# Altium schematic sheet PCB-Tester-Board-V1.SchDoc: PCB-Tester top block diagram
size A4; Date: JUN 2020; CheckedBy: Moerz, Hoeren; Author: Rudziński; CompanyName: TDK-Micronas GmbH; DrawnBy: Rudziński; Engineer: Rudziński; Organization: Test Engineering; Address1: Hans-Bunte-Strasse 19; Address2: D-79108 Freiburg; Address3: Germany; DocumentNumber: U33110; Revision: V1.0; SheetNumber: 1; SheetTotal: 20; DateDraw: JUN 2020; DateChecked: 2020-06-19; Workspace: Workspace; TitleTyp: Title-Typ; PageSetup: Record=PageOptions|CenterHorizontal=True|CenterVertical=True|PrintScale=0.97|XCorrection=1.00|YCorrection=1.00|PrintKind=0|BorderSize=5000000|LeftOffset=0|BottomOffset=0|Orientation=2|PaperLength=1000|PaperWidth=1000|Scale=100|PaperSource=7|PrintQuality=-3|MediaType=1|DitherType=10|PrintScaleMode=1|PaperKind=A4|PaperIndex=9
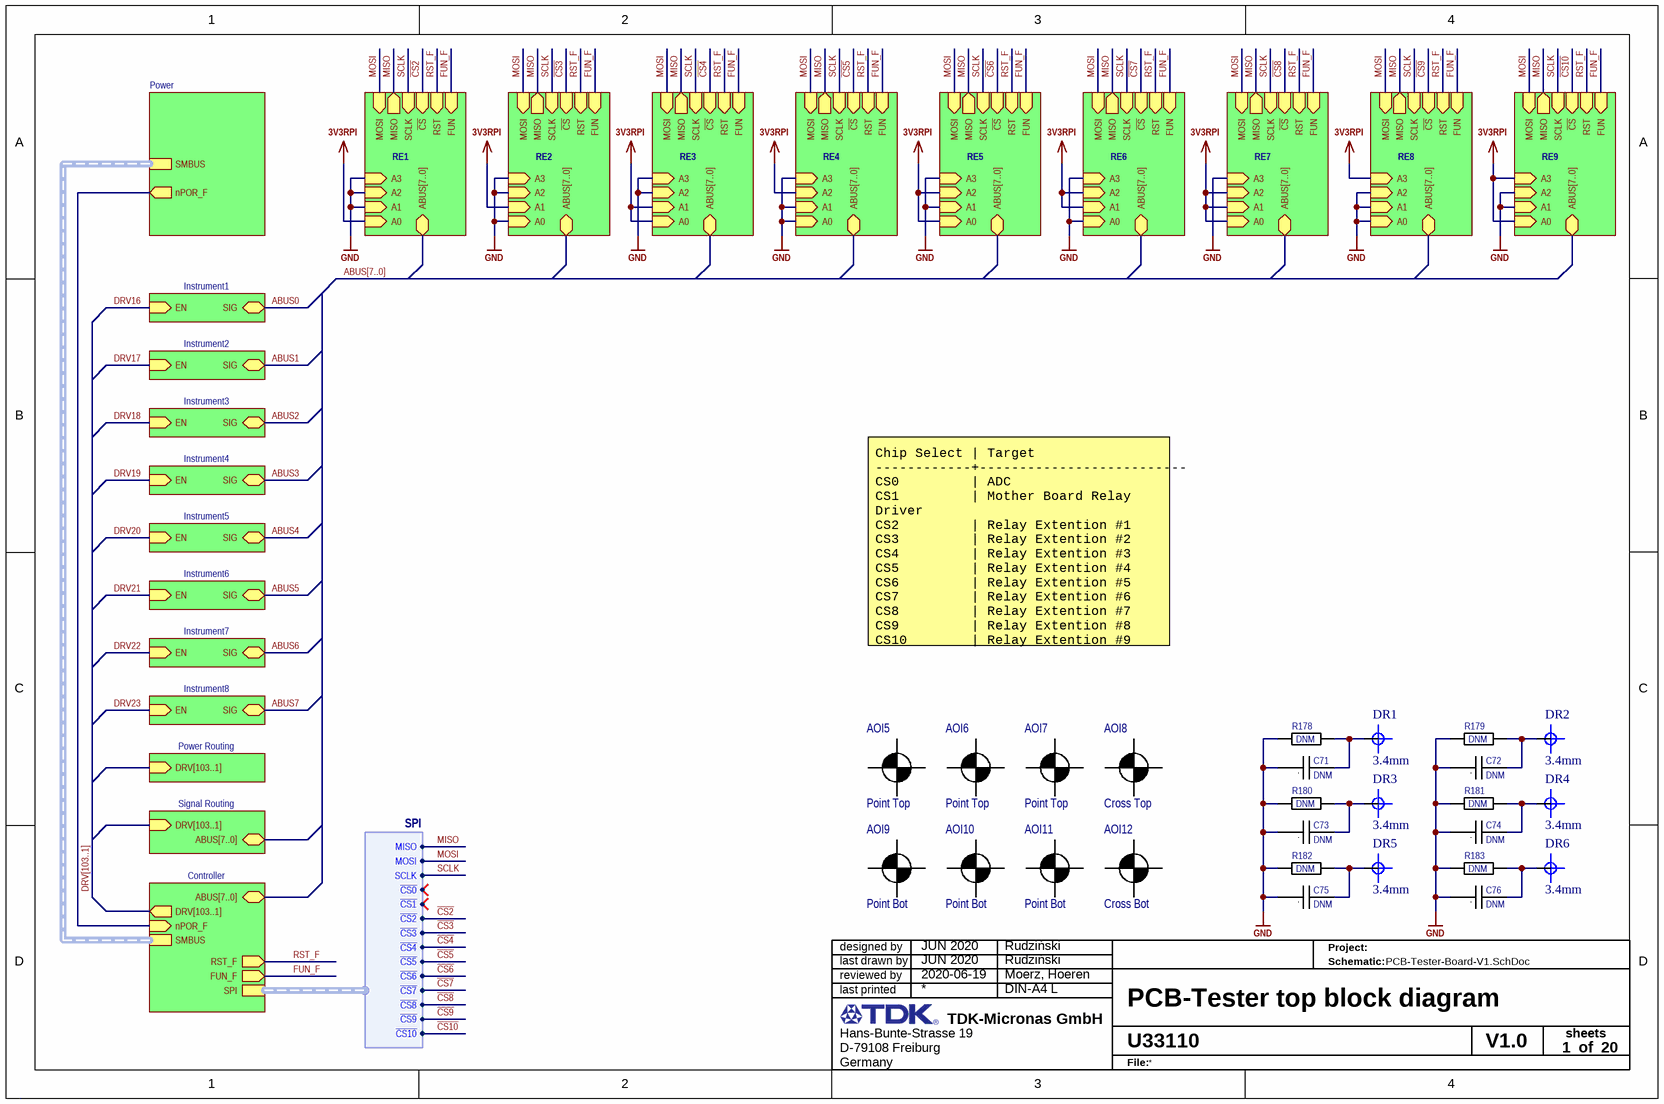
[diagram p0: PCB-Tester-Board-V1.SchDoc]

## Parts
AOI5  Shape: Point Top  [Fiducial Point]  (hidden comment: AOI)  (no BOM)
AOI6  Shape: Point Top  [Fiducial Point]  (hidden comment: AOI)  (no BOM)
AOI7  Shape: Point Top  [Fiducial Point]  (hidden comment: AOI)  (no BOM)
AOI8  Shape: Cross Top  [Fiducial Cross]  (hidden comment: AOI)  (no BOM)
AOI9  Shape: Point Bot  [Fiducial Point]  (hidden comment: AOI)  (no BOM)
AOI10  Shape: Point Bot  [Fiducial Point]  (hidden comment: AOI)  (no BOM)
AOI11  Shape: Point Bot  [Fiducial Point]  (hidden comment: AOI)  (no BOM)
AOI12  Shape: Cross Bot  [Fiducial Cross]  (hidden comment: AOI)  (no BOM)
C71  value DNM  [C1206 Reflow]  (hidden comment: C)  (no BOM)
C72  value DNM  [C1206 Reflow]  (hidden comment: C)  (no BOM)
C73  value DNM  [C1206 Reflow]  (hidden comment: C)  (no BOM)
C74  value DNM  [C1206 Reflow]  (hidden comment: C)  (no BOM)
C75  value DNM  [C1206 Reflow]  (hidden comment: C)  (no BOM)
C76  value DNM  [C1206 Reflow]  (hidden comment: C)  (no BOM)
DR1  3.4mm  [HOLE_3.4mm]  (no BOM)
DR2  3.4mm  [HOLE_3.4mm]  (no BOM)
DR3  3.4mm  [HOLE_3.4mm]  (no BOM)
DR4  3.4mm  [HOLE_3.4mm]  (no BOM)
DR5  3.4mm  [HOLE_3.4mm]  (no BOM)
DR6  3.4mm  [HOLE_3.4mm]  (no BOM)
R178  value DNM  [R1206 Reflow]  (hidden comment: R)  (no BOM)
R179  value DNM  [R1206 Reflow]  (hidden comment: R)  (no BOM)
R180  value DNM  [R1206 Reflow]  (hidden comment: R)  (no BOM)
R181  value DNM  [R1206 Reflow]  (hidden comment: R)  (no BOM)
R182  value DNM  [R1206 Reflow]  (hidden comment: R)  (no BOM)
R183  value DNM  [R1206 Reflow]  (hidden comment: R)  (no BOM)

## Sub-sheets
Controller = Controller.SchDoc: ABUS[7..0] (bidir), SPI (harness SPI), DRV[103..1] (out), SMBUS (harness SMBUS), nPOR_F (in), FUN_F (out), RST_F (out)
Instrument1 = Instrument.SchDoc: EN (in), SIG (bidir)
Instrument2 = Instrument.SchDoc: EN (in), SIG (bidir)
Instrument3 = Instrument.SchDoc: EN (in), SIG (bidir)
Instrument4 = Instrument.SchDoc: EN (in), SIG (bidir)
Instrument5 = Instrument.SchDoc: EN (in), SIG (bidir)
Instrument6 = Instrument.SchDoc: EN (in), SIG (bidir)
Instrument7 = Instrument.SchDoc: EN (in), SIG (bidir)
Instrument8 = Instrument.SchDoc: EN (in), SIG (bidir)
Power = Power.SchDoc: SMBUS (harness SMBUS), nPOR_F (out)
Power Routing = PowerRouting.SchDoc: DRV[103..1] (in)
RE1 = RelayExtension.SchDoc: ABUS[7..0] (bidir), SCLK (in), ~{CS} (in), MISO (out), MOSI (in), A3 (in), A2 (in), A1 (in), A0 (in), RST (in), FUN (in)
RE2 = RelayExtension.SchDoc: ABUS[7..0] (bidir), MOSI (in), MISO (out), ~{CS} (in), SCLK (in), A2 (in), A3 (in), A1 (in), A0 (in), RST (in), FUN (in)
RE3 = RelayExtension.SchDoc: ABUS[7..0] (bidir), MISO (out), SCLK (in), ~{CS} (in), MOSI (in), A2 (in), A3 (in), A1 (in), A0 (in), RST (in), FUN (in)
RE4 = RelayExtension.SchDoc: ABUS[7..0] (bidir), ~{CS} (in), SCLK (in), MOSI (in), MISO (out), A0 (in), A1 (in), A2 (in), A3 (in), RST (in), FUN (in)
RE5 = RelayExtension.SchDoc: ABUS[7..0] (bidir), SCLK (in), MISO (out), MOSI (in), ~{CS} (in), A3 (in), A2 (in), A1 (in), A0 (in), RST (in), FUN (in)
RE6 = RelayExtension.SchDoc: ABUS[7..0] (bidir), MOSI (in), ~{CS} (in), MISO (out), SCLK (in), A3 (in), A0 (in), A1 (in), A2 (in), RST (in), FUN (in)
RE7 = RelayExtension.SchDoc: ABUS[7..0] (bidir), MOSI (in), SCLK (in), MISO (out), ~{CS} (in), A0 (in), A1 (in), A2 (in), A3 (in), RST (in), FUN (in)
RE8 = RelayExtension.SchDoc: ABUS[7..0] (bidir), MOSI (in), MISO (out), ~{CS} (in), SCLK (in), A3 (in), A2 (in), A1 (in), A0 (in), RST (in), FUN (in)
RE9 = RelayExtension.SchDoc: ABUS[7..0] (bidir), MISO (out), SCLK (in), MOSI (in), ~{CS} (in), A3 (in), A2 (in), A1 (in), A0 (in), RST (in), FUN (in)
Signal Routing = SignalRouting.SchDoc: ABUS[7..0] (bidir), DRV[103..1] (in)

## Harnesses
SPI: MISO, MOSI, SCLK, ~{CS0}, ~{CS1}, ~{CS2}, ~{CS3}, ~{CS4}, ~{CS5}, ~{CS6}, ~{CS7}, ~{CS8}, ~{CS9}, ~{CS10}

## Nets
3V3RPI: sheet RE2/A1, sheet RE3/A1, sheet RE3/A0, sheet RE4/A2, sheet RE5/A2, sheet RE5/A0, sheet RE6/A1, sheet RE6/A2, sheet RE7/A0, sheet RE7/A1, sheet RE7/A2, sheet RE8/A3, sheet RE1/A0, sheet RE9/A3, sheet RE9/A0
GND: C71.1 C72.1 C73.1 C74.1 C75.1 C76.1 R178.2 R179.2 R180.2 R181.2 R182.2 R183.2 ; sheet RE2/A2, sheet RE2/A3, sheet RE2/A0, sheet RE3/A2, sheet RE3/A3, sheet RE4/A0, sheet RE4/A1, sheet RE4/A3, sheet RE5/A3, sheet RE5/A1, sheet RE6/A3, sheet RE6/A0, sheet RE7/A3, sheet RE8/A2, sheet RE8/A1, sheet RE8/A0, sheet RE1/A3, sheet RE1/A2, sheet RE1/A1, sheet RE9/A2, sheet RE9/A1
~{CS2}: sheet RE1/~{CS}, sheet Controller/SPI.~{CS2}
~{CS3}: sheet RE2/~{CS}, sheet Controller/SPI.~{CS3}
~{CS4}: sheet RE3/~{CS}, sheet Controller/SPI.~{CS4}
~{CS5}: sheet RE4/~{CS}, sheet Controller/SPI.~{CS5}
~{CS6}: sheet RE5/~{CS}, sheet Controller/SPI.~{CS6}
~{CS7}: sheet RE6/~{CS}, sheet Controller/SPI.~{CS7}
~{CS8}: sheet RE7/~{CS}, sheet Controller/SPI.~{CS8}
~{CS9}: sheet RE8/~{CS}, sheet Controller/SPI.~{CS9}
~{CS10}: sheet RE9/~{CS}, sheet Controller/SPI.~{CS10}
ABUS0: sheet Instrument1/SIG
ABUS1: sheet Instrument2/SIG
ABUS2: sheet Instrument3/SIG
ABUS3: sheet Instrument4/SIG
ABUS4: sheet Instrument5/SIG
ABUS5: sheet Instrument6/SIG
ABUS6: sheet Instrument7/SIG
ABUS7: sheet Instrument8/SIG
DRV16: sheet Instrument1/EN
DRV17: sheet Instrument2/EN
DRV18: sheet Instrument3/EN
DRV19: sheet Instrument4/EN
DRV20: sheet Instrument5/EN
DRV21: sheet Instrument6/EN
DRV22: sheet Instrument7/EN
DRV23: sheet Instrument8/EN
FUN_F: sheet RE2/FUN, sheet Controller/FUN_F, sheet RE3/FUN, sheet RE4/FUN, sheet RE5/FUN, sheet RE6/FUN, sheet RE7/FUN, sheet RE8/FUN, sheet RE1/FUN, sheet RE9/FUN
MISO: sheet RE2/MISO, sheet RE3/MISO, sheet RE4/MISO, sheet RE5/MISO, sheet RE6/MISO, sheet RE7/MISO, sheet RE8/MISO, sheet RE1/MISO, sheet RE9/MISO, sheet Controller/SPI.MISO
MOSI: sheet RE2/MOSI, sheet RE3/MOSI, sheet RE4/MOSI, sheet RE5/MOSI, sheet RE6/MOSI, sheet RE7/MOSI, sheet RE8/MOSI, sheet RE1/MOSI, sheet RE9/MOSI, sheet Controller/SPI.MOSI
RST_F: sheet RE2/RST, sheet Controller/RST_F, sheet RE3/RST, sheet RE4/RST, sheet RE5/RST, sheet RE6/RST, sheet RE7/RST, sheet RE8/RST, sheet RE1/RST, sheet RE9/RST
SCLK: sheet RE2/SCLK, sheet RE3/SCLK, sheet RE4/SCLK, sheet RE5/SCLK, sheet RE6/SCLK, sheet RE7/SCLK, sheet RE8/SCLK, sheet RE1/SCLK, sheet RE9/SCLK, sheet Controller/SPI.SCLK
NetC71_2: C71.2 DR1.1(OUT3) R178.1
NetC72_2: C72.2 DR2.1(OUT3) R179.1
NetC73_2: C73.2 DR3.1(OUT3) R180.1
NetC74_2: C74.2 DR4.1(OUT3) R181.1
NetC75_2: C75.2 DR5.1(OUT3) R182.1
NetC76_2: C76.2 DR6.1(OUT3) R183.1
(unnamed): sheet Power/nPOR_F, sheet Controller/nPOR_F

## Buses and harness runs
bus ABUS[7..0] = sheet Controller/ABUS[7..0] = sheet RE1/ABUS[7..0] = sheet RE2/ABUS[7..0] = sheet RE3/ABUS[7..0] = sheet RE4/ABUS[7..0] = sheet RE5/ABUS[7..0] = sheet RE6/ABUS[7..0] = sheet RE7/ABUS[7..0] = sheet RE8/ABUS[7..0] = sheet RE9/ABUS[7..0] = sheet Signal Routing/ABUS[7..0]
bus DRV[103..1] = sheet Controller/DRV[103..1] = sheet Power Routing/DRV[103..1] = sheet Signal Routing/DRV[103..1]
harness sheet Controller/SMBUS = sheet Power/SMBUS

## Notes on the sheet
- Chip Select | Target
  ------------+--------------------------
  CS0         | ADC
  CS1         | Mother Board Relay Driver
  CS2         | Relay Extention #1
  CS3         | Relay Extention #2
  CS4         | Relay Extention #3
  CS5         | Relay Extention #4
  CS6         | Relay Extention #5
  CS7         | Relay Extention #6
  CS8         | Relay Extention #7
  CS9         | Relay Extention #8
  CS10        | Relay Extention #9
- designed by
- reviewed by
- last drawn by
- Project:
- Schematic:
- last printed
- DIN-A4 L
- sheets
- of
- File:
- (in symbol C) .

## Library data of the parts
AOI5-AOI12 = Fiducial: Assembly AOI; 13. Created Date/Name: AUG2018/Hören; 01. Distributor: N/A; 02. Distributor Part Number: N/A; 03. Unit Price: N/A; 04. Manufacturer: N/A; 05. Quantity: N/A; 06. Data Sheet: N/A; 07. Manufacturer  Part Number: N/A; 08. Inhouse Stock: N/A; 09. Operating Temperature: N/A; 10. Weight: N/A; 11. RoHS: N/A; 12.UL94 Flammability: N/A; ComponentLink1Description: Info; ComponentLink2Description: Info
C71-C76 = C: Capacitor Unpolarized; Tolerance: ±20%; 13. Created Date/Name: AUG2018/Hören; ComponentLink1Description: Info; ComponentLink1URL: *; 09. Operating Temperature: -xx..+yy°C; 11. RoHS: ???; ComponentLink2Description: DataSheet
DR1-DR6 = Drill-3.2mm-M3-C: Fiducal 90 mil; POPULATED: no part
R178-R183 = R: Resistor; Tolerance: ±1%; 13. Created Date/Name: AUG2018/Hören; ComponentLink1URL: *; ComponentLink1Description: Info; 09. Operating Temperature: -xx..+yy°C; 11. RoHS: ???; ComponentLink2Description: DataSheet; Package: *